# EAGLE schematic Control board POD (CMS) (EAGLE 6.1)
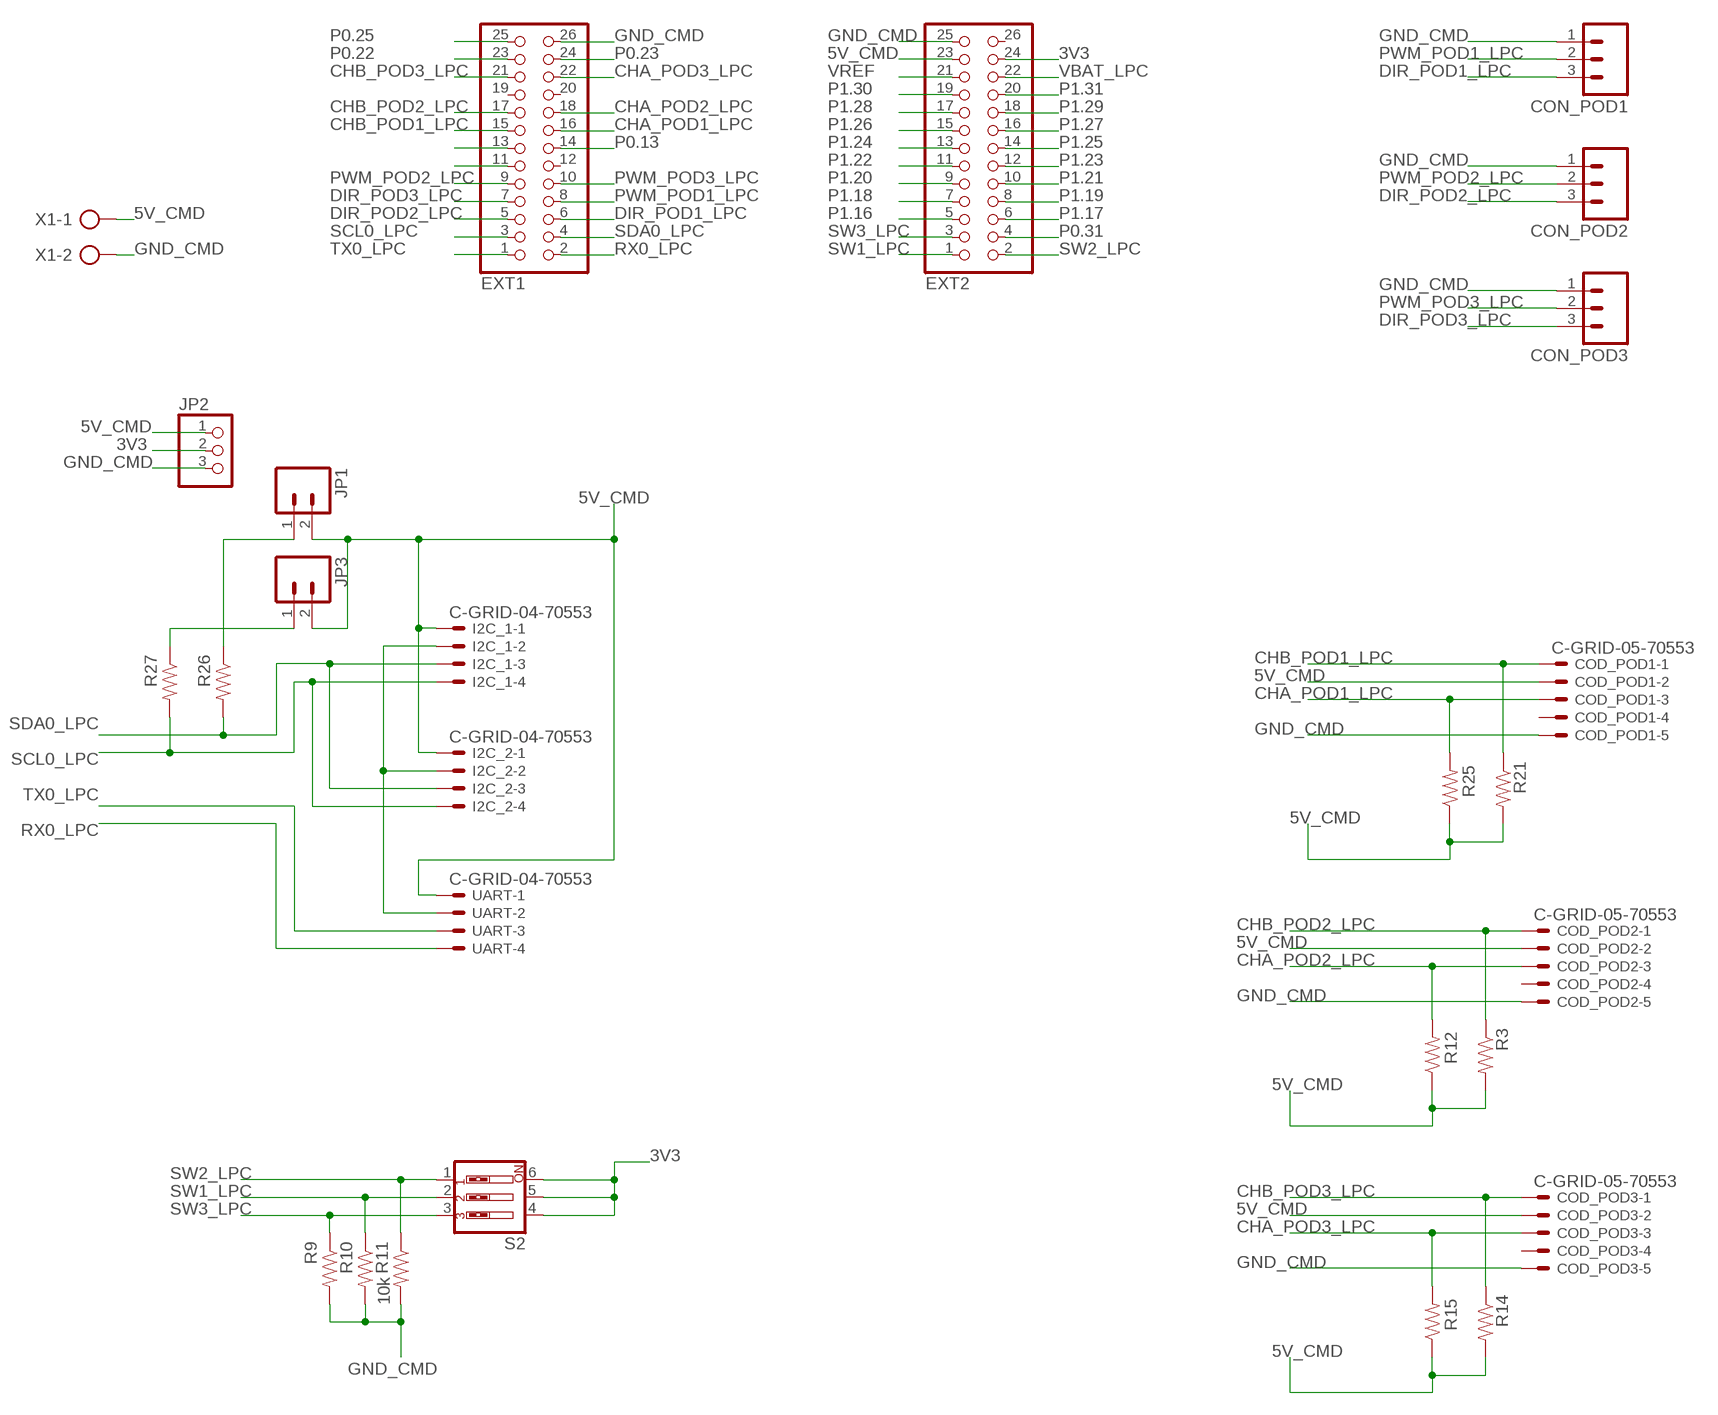
[diagram p0: schematic, sheet 1, part 1 of 2]
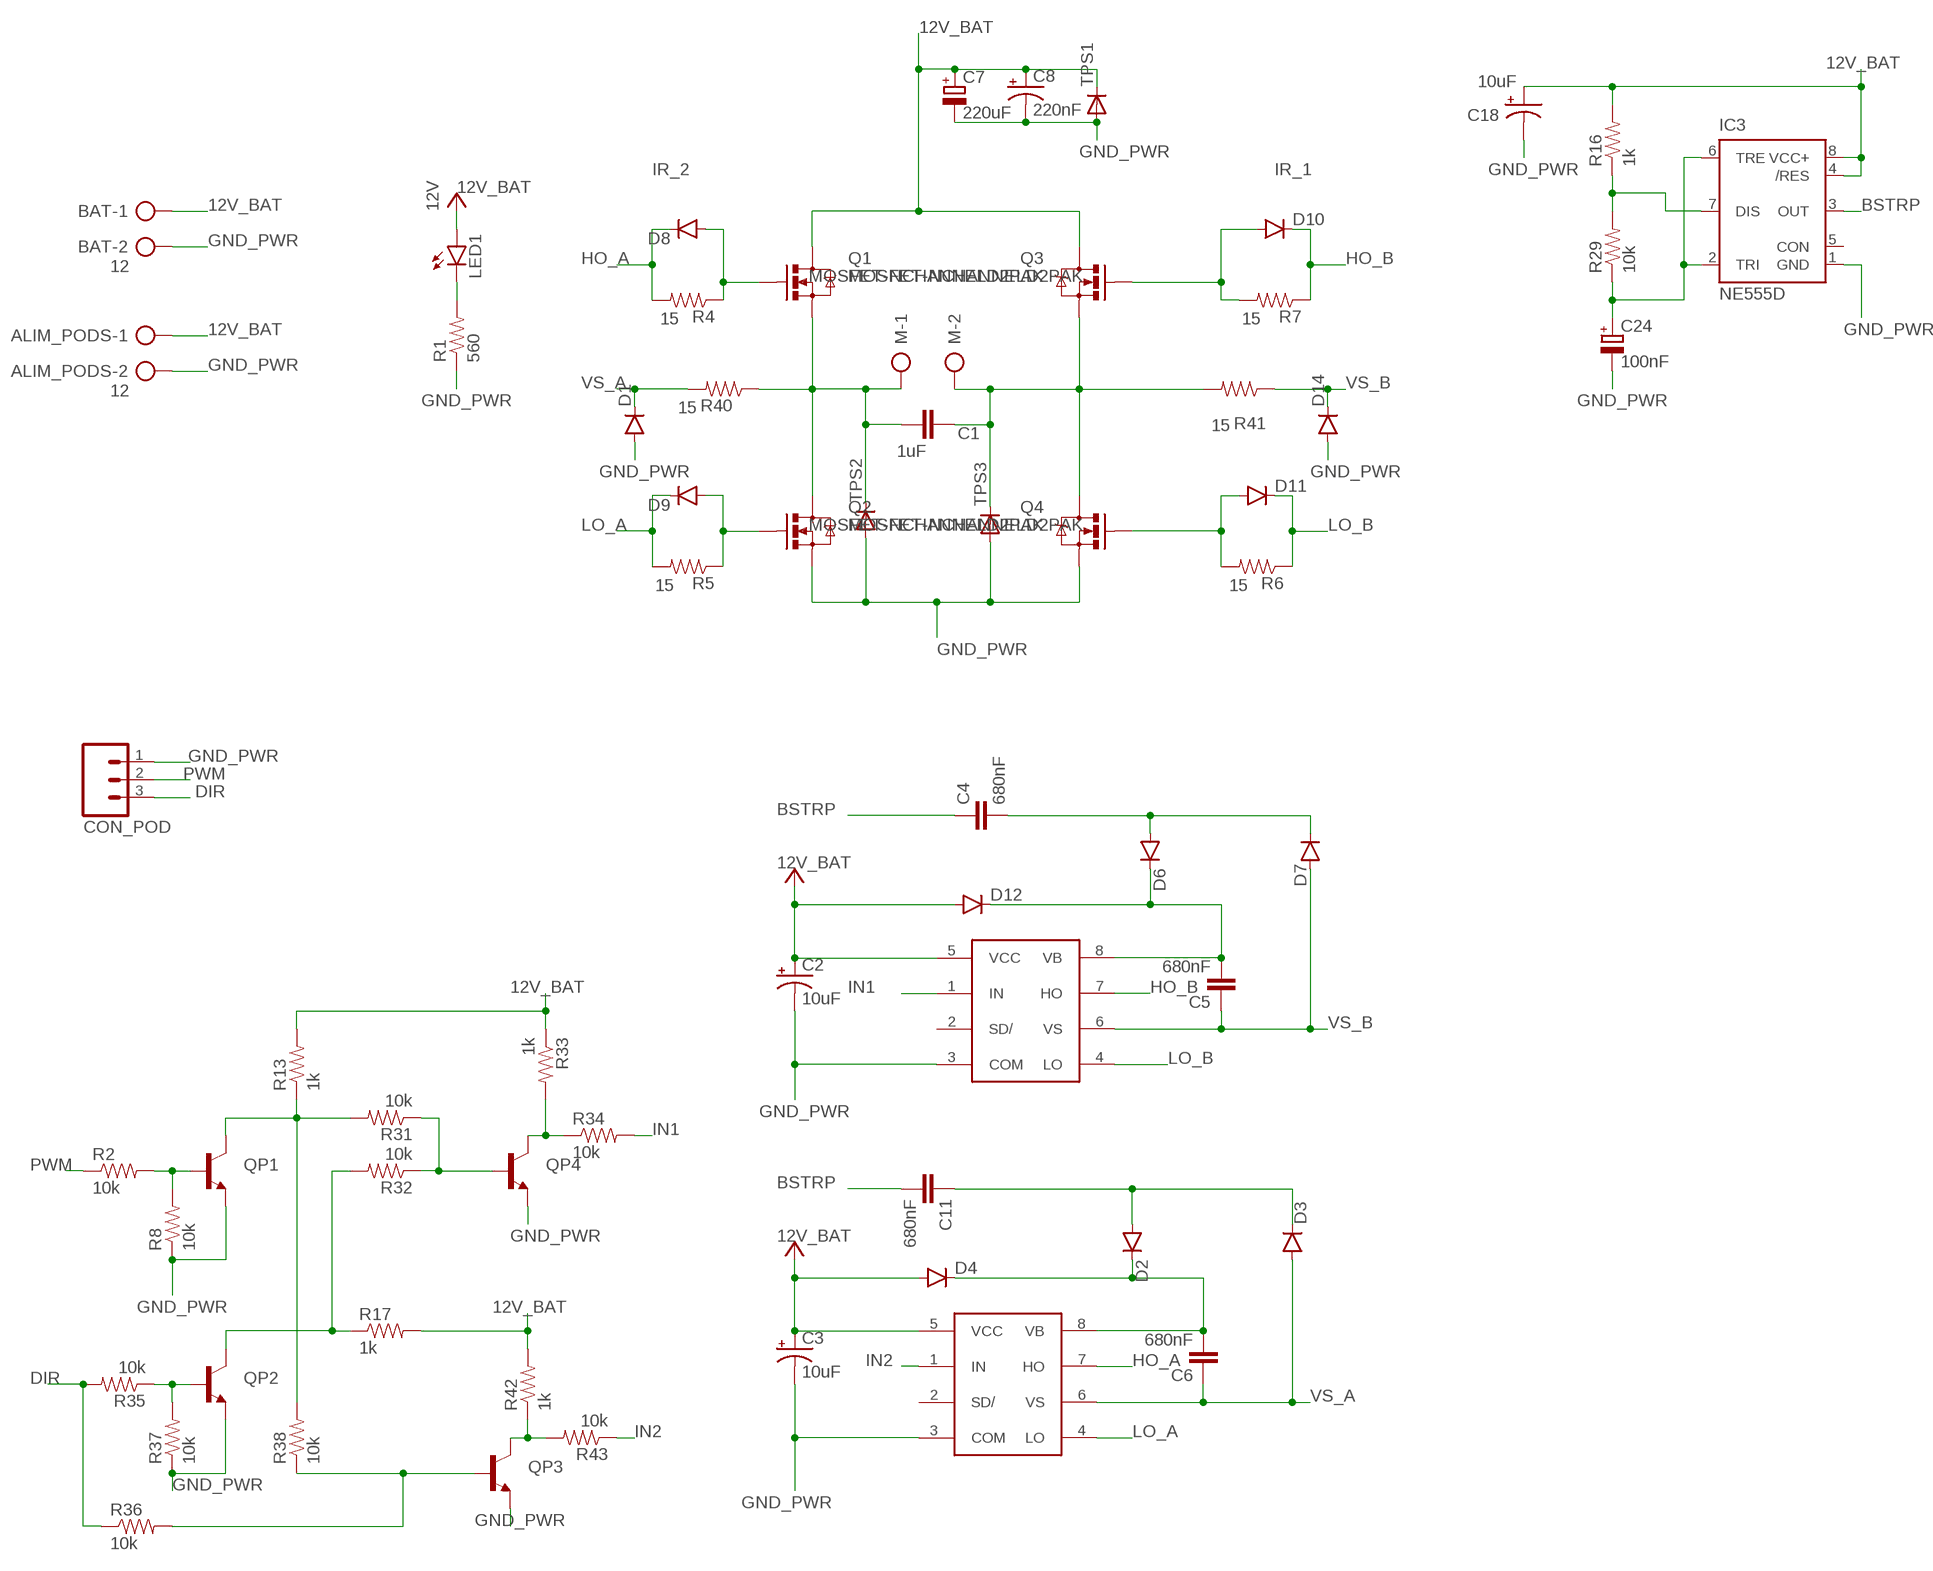
[diagram p1: schematic, sheet 1, part 2 of 2]

## Parts
ALIM_PODS  12  AK500/2  [AK500/2]
BAT  12  AK500/2  [AK500/2]
C1  1uF  CAP0603-CAP  [0603-CAP]
C2  10uF  10UF-16V-10%(TANT)  [EIA3216]
C3  10uF  10UF-16V-10%(TANT)  [EIA3216]
C4  680nF  CAP0805  [0805]
C5  680nF  CAP1206  [1206]
C6  680nF  CAP1206  [1206]
C7  220uF  CPOL-EUD/7343-31R  [D/7343-31R]
C8  220nF  10UF-16V-10%(TANT)  [EIA3216]
C11  680nF  CAP0805  [0805]
C18  10uF  10UF-16V-10%(TANT)  [EIA3216]
C24  100nF  CPOL-EUR/2012-12R  [R/2012-12R]
COD_POD1  C-GRID-05-70553  [70553-05]
COD_POD2  C-GRID-05-70553  [70553-05]
COD_POD3  C-GRID-05-70553  [70553-05]
CON_POD  M03PTH  [1X03]
CON_POD1  M03PTH  [1X03]
CON_POD2  M03PTH  [1X03]
CON_POD3  M03PTH  [1X03]
D1  DIODESOD  [SOD-323]
D2  DIODESOD  [SOD-323]
D3  DIODESOD  [SOD-323]
D4  DIODESOD  [SOD-323]
D6  DIODESOD  [SOD-323]
D7  DIODESOD  [SOD-323]
D8  DIODESOD  [SOD-323]
D9  DIODESOD  [SOD-323]
D10  DIODESOD  [SOD-323]
D11  DIODESOD  [SOD-323]
D12  DIODESOD  [SOD-323]
D14  DIODESOD  [SOD-323]
EXT1  PINHD-2X13  [2X13]
EXT2  PINHD-2X13  [2X13]
I2C_1  C-GRID-04-70553  [70553-04]
I2C_2  C-GRID-04-70553  [70553-04]
IC3  NE555D  [SO08]
IR2184SPBF1  IR2184SPBF  [SO08]
IR2184SPBF2  IR2184SPBF  [SO08]
JP1  M02PTH  [1X02]
JP2  PINHD-1X3  [1X03]
JP3  M02PTH  [1X02]
LED1  LED-WHITE  [LED-1206]
M  AK500/2  [AK500/2]
Q1  MOSFET-NCHANNELD2PAK  [D2PAK-3]
Q2  MOSFET-NCHANNELD2PAK  [D2PAK-3]
Q3  MOSFET-NCHANNELD2PAK  [D2PAK-3]
Q4  MOSFET-NCHANNELD2PAK  [D2PAK-3]
QP1  TRANSISTOR_NPNSOT23-3  [SOT23-3]
QP2  TRANSISTOR_NPNSOT23-3  [SOT23-3]
QP3  TRANSISTOR_NPNSOT23-3  [SOT23-3]
QP4  TRANSISTOR_NPNSOT23-3  [SOT23-3]
R1  560  RESISTOR1206  [1206]
R2  10k  RESISTOR0603-RES  [0603-RES]
R3  3k3  RESISTOR0603-RES  [0603-RES]
R4  15  RESISTOR0805-RES  [0805]
R5  15  RESISTOR0805-RES  [0805]
R6  15  RESISTOR0805-RES  [0805]
R7  15  RESISTOR0805-RES  [0805]
R8  10k  RESISTOR0603-RES  [0603-RES]
R9  10k  RESISTOR0603-RES  [0603-RES]
R10  10k  RESISTOR0603-RES  [0603-RES]
R11  10k  RESISTOR0603-RES  [0603-RES]
R12  3k3  RESISTOR0603-RES  [0603-RES]
R13  1k  RESISTOR0603-RES  [0603-RES]
R14  3k3  RESISTOR0603-RES  [0603-RES]
R15  3k3  RESISTOR0603-RES  [0603-RES]
R16  1k  RESISTOR0603-RES  [0603-RES]
R17  1k  RESISTOR0603-RES  [0603-RES]
R21  3k3  RESISTOR0603-RES  [0603-RES]
R25  3k3  RESISTOR0603-RES  [0603-RES]
R26  3.3k  RESISTOR0603-RES  [0603-RES]
R27  3.3k  RESISTOR0603-RES  [0603-RES]
R29  10k  RESISTOR0603-RES  [0603-RES]
R31  10k  RESISTOR0603-RES  [0603-RES]
R32  10k  RESISTOR0603-RES  [0603-RES]
R33  1k  RESISTOR0603-RES  [0603-RES]
R34  10k  RESISTOR0603-RES  [0603-RES]
R35  10k  RESISTOR0603-RES  [0603-RES]
R36  10k  RESISTOR0603-RES  [0603-RES]
R37  10k  RESISTOR0603-RES  [0603-RES]
R38  10k  RESISTOR0603-RES  [0603-RES]
R40  15  RESISTOR0603-RES  [0603-RES]
R41  15  RESISTOR0603-RES  [0603-RES]
R42  1k  RESISTOR0603-RES  [0603-RES]
R43  10k  RESISTOR0603-RES  [0603-RES]
S2  SW_DIP-3  [EDG-03]
TPS1  DIODE-SMC  [SMC]
TPS2  DIODE-SMC  [SMC]
TPS3  DIODE-SMC  [SMC]
UART  C-GRID-04-70553  [70553-04]
X1  AK500/2  [AK500/2]

## Nets
3V3 [POWER]: EXT2.24 JP2.2 S2.4 S2.5 S2.6
5V_CMD: COD_POD1.2 COD_POD2.2 COD_POD3.2 EXT2.23 I2C_1.1 I2C_2.1 JP1.2 JP2.1 JP3.2 R3.2 R12.1 R14.2 R15.1 R21.2 R25.1 UART.1 X1.1
12V_BAT: ALIM_PODS.1 BAT.1 C2.A(+) C3.A(+) C7.+ C8.A(+) C18.A(+) D4.A D12.A IC3.4(/RES) IC3.8(VCC+) IR2184SPBF1.5(VCC) IR2184SPBF2.5(VCC) LED1.A Q1.4(D) Q3.4(D) R13.2 R16.2 R17.2 R33.1 R42.2 TPS1.C ; supply symbol labelled 12V
BSTRP: C4.1 C11.2 IC3.3(OUT)
CHA_POD1_LPC: COD_POD1.3 EXT1.16 R25.2
CHA_POD2_LPC: COD_POD2.3 EXT1.18 R12.2
CHA_POD3_LPC: COD_POD3.3 EXT1.22 R15.2
CHB_POD1_LPC: COD_POD1.1 EXT1.15 R21.1
CHB_POD2_LPC: COD_POD2.1 EXT1.17 R3.1
CHB_POD3_LPC: COD_POD3.1 EXT1.21 R14.1
DIR: CON_POD.3 R35.2 R36.1
DIR_POD1_LPC: CON_POD1.3 EXT1.6
DIR_POD2_LPC: CON_POD2.3 EXT1.5
DIR_POD3_LPC: CON_POD3.3 EXT1.7
GATE_Q3: D9.A Q2.1(G) R5.1
GATE_Q4: D10.A Q3.1(G) R7.2
GND_CMD [POWER]: COD_POD1.5 COD_POD2.5 COD_POD3.5 CON_POD1.1 CON_POD2.1 CON_POD3.1 EXT1.26 EXT2.25 I2C_1.2 I2C_2.2 JP2.3 R9.2 R10.2 R11.2 UART.2 X1.2
GND_PWR: ALIM_PODS.2 BAT.2 C2.C(-) C3.C(-) C7.- C8.C(-) C18.C(-) C24.- CON_POD.1 D1.A D14.A IC3.1(GND) IR2184SPBF1.3(COM) IR2184SPBF2.3(COM) Q2.3(S) Q4.3(S) QP1.2(E) QP2.2(E) QP3.2(E) QP4.2(E) R1.1 R8.1 R37.1 TPS1.A TPS2.A TPS3.A
HO_A: D8.C IR2184SPBF2.7(HO) R4.2
HO_B: D10.C IR2184SPBF1.7(HO) R7.1
IN1: IR2184SPBF1.1(IN) R34.2
IN2: IR2184SPBF2.1(IN) R43.1
LO_A: D9.C IR2184SPBF2.4(LO) R5.2
LO_B: D11.C IR2184SPBF1.4(LO) R6.1
N$1: C11.1 D2.A D3.C
N$2: D8.A Q1.1(G) R4.1
N$3: C1.2 M.2 Q3.3(S) Q4.4(D) R41.2 TPS3.C
N$4: C6.2 D2.C D4.C IR2184SPBF2.8(VB)
N$5: C4.2 D6.A D7.C
N$7: C5.2 D6.C D12.C IR2184SPBF1.8(VB)
N$10: LED1.C R1.2
N$11: C1.1 M.1 Q1.3(S) Q2.4(D) R40.1 TPS2.C
N$12: D11.A Q4.1(G) R6.2
N$33: IC3.7(DIS) R16.1 R29.2
N$37: C24.+ IC3.2(TRI) IC3.6(TRE) R29.1
N$52: JP1.1 R26.1
N$53: QP1.1(B) R2.2 R8.2
N$54: JP3.1 R27.1
N$56: QP2.1(B) R35.1 R37.2
N$58: QP3.1(B) R36.2 R38.1
N$61: QP1.3(C) R13.1 R31.2 R38.2
N$63: QP4.1(B) R31.1 R32.1
N$64: QP2.3(C) R17.1 R32.2
N$65: QP4.3(C) R33.2 R34.1
N$69: QP3.3(C) R42.1 R43.2
P0.13: EXT1.14
P0.22: EXT1.23
P0.23: EXT1.24
P0.25: EXT1.25
P0.31: EXT2.4
P1.16: EXT2.5
P1.17: EXT2.6
P1.18: EXT2.7
P1.19: EXT2.8
P1.20: EXT2.9
P1.21: EXT2.10
P1.22: EXT2.11
P1.23: EXT2.12
P1.24: EXT2.13
P1.25: EXT2.14
P1.26: EXT2.15
P1.27: EXT2.16
P1.28: EXT2.17
P1.29: EXT2.18
P1.30: EXT2.19
P1.31: EXT2.20
PWM: CON_POD.2 R2.1
PWM_POD1_LPC: CON_POD1.2 EXT1.8
PWM_POD2_LPC: CON_POD2.2 EXT1.9
PWM_POD3_LPC: CON_POD3.2 EXT1.10
RX0_LPC: EXT1.2 UART.4
SCL0_LPC: EXT1.3 I2C_1.4 I2C_2.4 R27.2
SD2_POD1_LPC: EXT1.11
SD2_POD3_LPC: EXT1.13
SDA0_LPC: EXT1.4 I2C_1.3 I2C_2.3 R26.2
SW1_LPC: EXT2.1 R10.1 S2.2
SW2_LPC: EXT2.2 R11.1 S2.1
SW3_LPC: EXT2.3 R9.1 S2.3
TX0_LPC: EXT1.1 UART.3
VBAT_LPC: EXT2.22
VREF: EXT2.21
VS_A: C6.1 D1.C D3.A IR2184SPBF2.6(VS) R40.2
VS_B: C5.1 D7.A D14.C IR2184SPBF1.6(VS) R41.1
Unconnected: COD_POD1.4 COD_POD2.4 COD_POD3.4 EXT1.12 EXT1.19 EXT1.20 EXT2.26 IC3.5(CON) IR2184SPBF1.2(SD/) IR2184SPBF2.2(SD/)

## Notes on the sheet
- IR_2 | IR_1

## Library data of the parts
ALIM_PODS BAT M X1 = con-ptr500:AK500/2: CONNECTOR; OC_FARNELL: unknown; OC_NEWARK: unknown
C1 = SparkFun:CAP: Capacitor Standard 0603 ceramic capacitor, and 0.1" leaded capacitor.
C2 C3 C18 = SparkFun-Capacitors:10UF-16V-10%(TANT): CAP-00811 1206/EIA-3216 Tantalum capacitor; PROD_ID: CAP-00811
C4-C6 C11 = SparkFun-Capacitors:CAP: Capacitor Standard 0603 ceramic capacitor, and 0.1" leaded capacitor.
C7 C24 = rcl:CPOL-EU: POLARIZED CAPACITOR, European symbol
C8 = SparkFun-Capacitors:10UF-16V-10%(TANT): CAP-00811 1206/EIA-3216 Tantalum capacitor; PROD_ID: CAP-00811; VALUE: 10uF
COD_POD1-COD_POD3 = con-molex:C-GRID-05: CONNECTOR wire to board 2.54 mm (0.100") pitch header; OC_FARNELL: unknown; OC_NEWARK: unknown
CON_POD CON_POD1-CON_POD3 = SparkFun-Connectors:M03: Header 3 Standard 3-pin 0.1" header. Use with straight break away headers (SKU : PRT-00116), right angle break away headers (PRT-00553), swiss pins (PRT-00743), machine pins (PRT-00117), and female headers (PRT-00115). Molex polarized connector foot print use with SKU : PRT-08232 with associated crimp pins and housings.
D1-D4 D6-D12 D14 = SparkFun-DiscreteSemi:DIODE: Diode These are standard reverse protection diodes and small signal diodes. SMA package can handle up to about 1A. SOD-323 can handle about 200mA. What the SOD-323 package when ordering, there are some mfgs out there that are 5-pin packages.; PROD_ID: DIO-09646
EXT1 EXT2 = pinhead:PINHD-2X13: PIN HEADER
I2C_1 I2C_2 UART = con-molex:C-GRID-04: CONNECTOR wire to board 2.54 mm (0.100") pitch header; OC_FARNELL: unknown; OC_NEWARK: unknown
IC3 = SparkFun:NE555: General purpose bipolar Timer
IR2184SPBF1 IR2184SPBF2 = IR2184SPBF:IR2184SPBF
JP1 JP3 = SparkFun:M02: Header 2 Standard 2-pin 0.1" header. Use with straight break away headers (SKU : PRT-00116), right angle break away headers (PRT-00553), swiss pins (PRT-00743), machine pins (PRT-00117), and female headers (PRT-00115). Molex polarized connector foot print use with SKU : PRT-08233 with associated crimp pins and housings.
JP2 = pinhead:PINHD-1X3: PIN HEADER
LED1 = SparkFun-LED:LED-WHITE: White SMD LEDs LilyPad 1206- DIO-09955; PROD_ID: DIO-09955; VALUE: WHITE
Q1-Q4 = SparkFun:MOSFET-NCHANNEL
QP1-QP4 = SparkFun:TRANSISTOR_NPN: Transistor NPN BJT configuration in SOT23 package. MMBT2222 is the common NPN we use. Double check BCE configuration again layout.
R1 = SparkFun:RESISTOR: Resistor Basic schematic elements and footprints for 0603, 1206, and PTH resistors.
R2-R17 R21 R25-R27 R29 R31-R38 R40-R43 = SparkFun-Passives:RESISTOR: Resistor Basic schematic elements and footprints for 0603, 1206, and PTH resistors.
S2 = special:SW_DIP-3: DIP SWITCH
TPS1-TPS3 = diode:DIODE-: DIODE

## Net classes
0 default: width 1 mm
1 LPC: width 0.5 mm
2 POWER: width 4 mm